# Altium schematic sheet StationRecharge.SchDoc
size A4
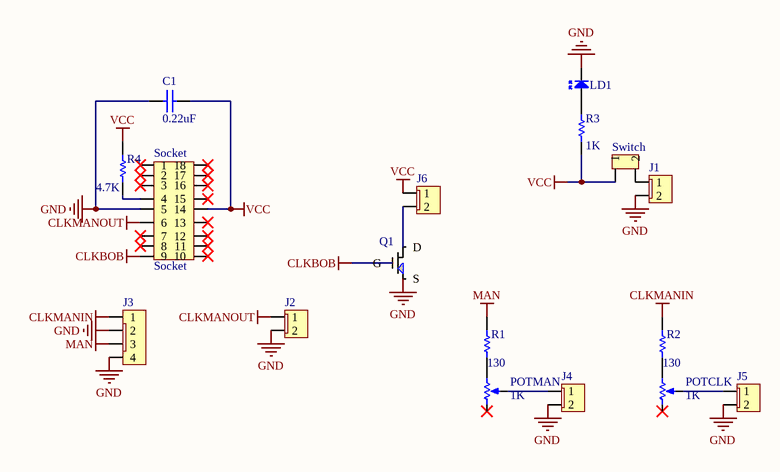
[diagram p0: StationRecharge.SchDoc]

## Parts
C1  value 0.22uF  [CER RAD-0.1]  (hidden comment: Cap Ceramic)
J1  Input  [MTA100-2]  (value not drawn)
J2  Input  [MTA100-2]  (value not drawn)
J3  MTA100-4  [MTA100-4 MF]  (value not drawn)
J4  Input  [MTA100-2]  (value not drawn)
J5  Input  [MTA100-2]  (value not drawn)
J6  Input  [MTA100-2]  (value not drawn)
LD1  Power Good  [LED 3mm Vertical]  (value not drawn)
Q1  Component_1  [PCBComponent_1]  (value not drawn)
R1  value 130  [AXIAL-0.3]  (hidden comment: Res1)
R2  value 130  [AXIAL-0.3]  (hidden comment: Res1)
R3  value 1K  [AXIAL-0.3]  (hidden comment: Res1)
R4  value 4.7K  [AXIAL-0.3]  (hidden comment: Res1)
Socket  Socket  [DIP18]
Switch  SwitchMini  [PCBComponent_1]  (value not drawn)
VR1  POTMAN  value 1K  [VR1]
VR2  POTCLK  value 1K  [VR1]

## Nets
CLKBOB: Q1.G Socket.9
CLKMANIN: J3.1 R2.2
CLKMANOUT: J2.1 Socket.6
GND: C1.1 J1.2 J2.2 J3.2 J3.4 J4.2 J5.2 LD1.2(K) Q1.S Socket.5
MAN: J3.3 R1.2
VCC: C1.2 J6.1 R3.1 R4.2 Socket.14 Switch.1
NetJ1_1: J1.1 Switch.2
NetJ4_1: J4.1 VR1.2(Tap)
NetJ5_1: J5.1 VR2.2(Tap)
NetJ6_2: J6.2 Q1.D
NetLD1_1: LD1.1(A) R3.2
NetR1_1: R1.1 VR1.3(Bot)
NetR2_1: R2.1 VR2.3(Bot)
NetR4_1: R4.1 Socket.4

Not connected (* = marked no-connect by the designer): Socket 1* 2* 3* 7* 8* 10* 11* 12* 13* 15* 16* 17* 18*; VR1 1(Top)*; VR2 1(Top)*

## Library data of the parts
C1 = Cap Ceramic: Capacitor; Published: 8-Jun-2000; LatestRevisionDate: 17-Jul-2002; LatestRevisionNote: Re-released for DXP Platform.; PackageReference: RAD-0.3; Publisher: Altium Limited; PackageDescription: Radial Cap, Thru-Hole; 2 Leads; 0.3 in Pin Spacing
J1 J2 J4-J6 = MTA100-2: MTA Male 0 Degres
J3 = MTA100-4: MTA100-4M
LD1 = LED 3mm Vertical: Through Hole; Published: 8-Jun-2000; LatestRevisionDate: 08-Jul-2005; LatestRevisionNote: Mech Layer 1 removed.; PackageReference: LED-1; Publisher: Altium Limited; PackageDescription: LED; 2 Leads; Comment_1: LED 3mm Vertical
R1-R4 = Res1: Resistor; Published: 8-Jun-2000; LatestRevisionDate: 17-Jul-2002; LatestRevisionNote: Re-released for DXP Platform.; PackageReference: AXIAL-0.3; Publisher: Altium Limited; PackageDescription: Axial Device, Thru-Hole; 2 Leads; 0.3 in Pin Spacing
VR1 VR2 = Res Pot 10T Vertical